# EAGLE schematic M5StickCplus (EAGLE 9.6.2)
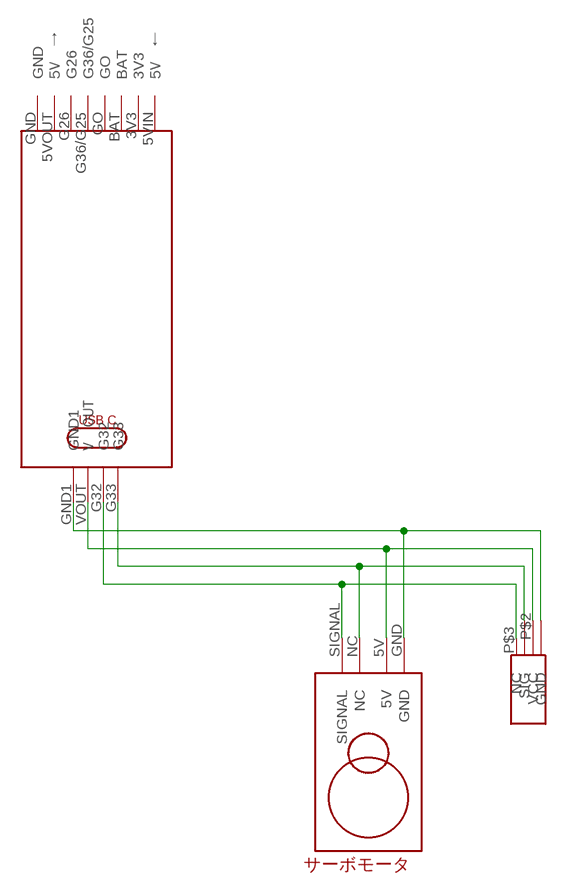
[diagram p0: schematic, sheet 1]

## Parts
U$1  FT1117M  [FT1117M]
U$2  M5STICKCPLUS  [M5STICK]
U$3  TECONNECTIVITY1005447-1  [TECONNECTIVITY1005447-1]

## Nets
N$1: U$1.GND U$2.GND1 U$3.P$1(GND)
N$2: U$1.5V U$2.VOUT(V　OUT) U$3.P$2(VCC)
N$3: U$1.NC U$2.G33 U$3.P$4(SIG)
N$4: U$1.SIGNAL U$2.G32 U$3.P$3(NC)
Unconnected: U$2.3V3 U$2.5VIN(5V　←) U$2.5VOUT(5V　→) U$2.BAT U$2.G26 U$2.G36/G25 U$2.GND U$2.GO

## Library data of the parts
U$1 = FT1117M:FT1117M
U$2 = M5stickcPlus:M5STICKCPLUS
U$3 = TE Connectivity 1005447-1:TECONNECTIVITY1005447-1